# Altium schematic sheet dc-dc.SchDoc
size A4
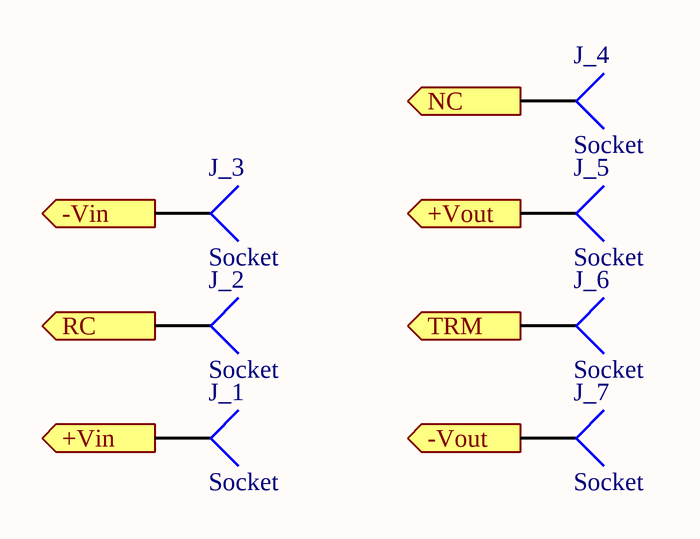
[diagram p0: dc-dc.SchDoc]

## Parts
J_1  Socket  [PIN1]
J_2  Socket  [PIN1]
J_3  Socket  [PIN1]
J_4  Socket  [PIN1]
J_5  Socket  [PIN1]
J_6  Socket  [PIN1]
J_7  Socket  [PIN1]

## Ports
+Vin (in), +Vout (out), -Vin (in), -Vout (out), NC (out), RC (in), TRM (out)

## Nets
+Vin: J_1.1 ; port +Vin
+Vout: J_5.1 ; port +Vout
-Vin: J_3.1 ; port -Vin
-Vout: J_7.1 ; port -Vout
NC: J_4.1 ; port NC
RC: J_2.1 ; port RC
TRM: J_6.1 ; port TRM

## Library data of the parts
J_1-J_7 = Socket: LatestRevisionDate: 17-Jul-2002; LatestRevisionNote: Re-released for DXP Platform.; Publisher: Altium Limited